# EAGLE schematic iron (EAGLE 8.3.2)
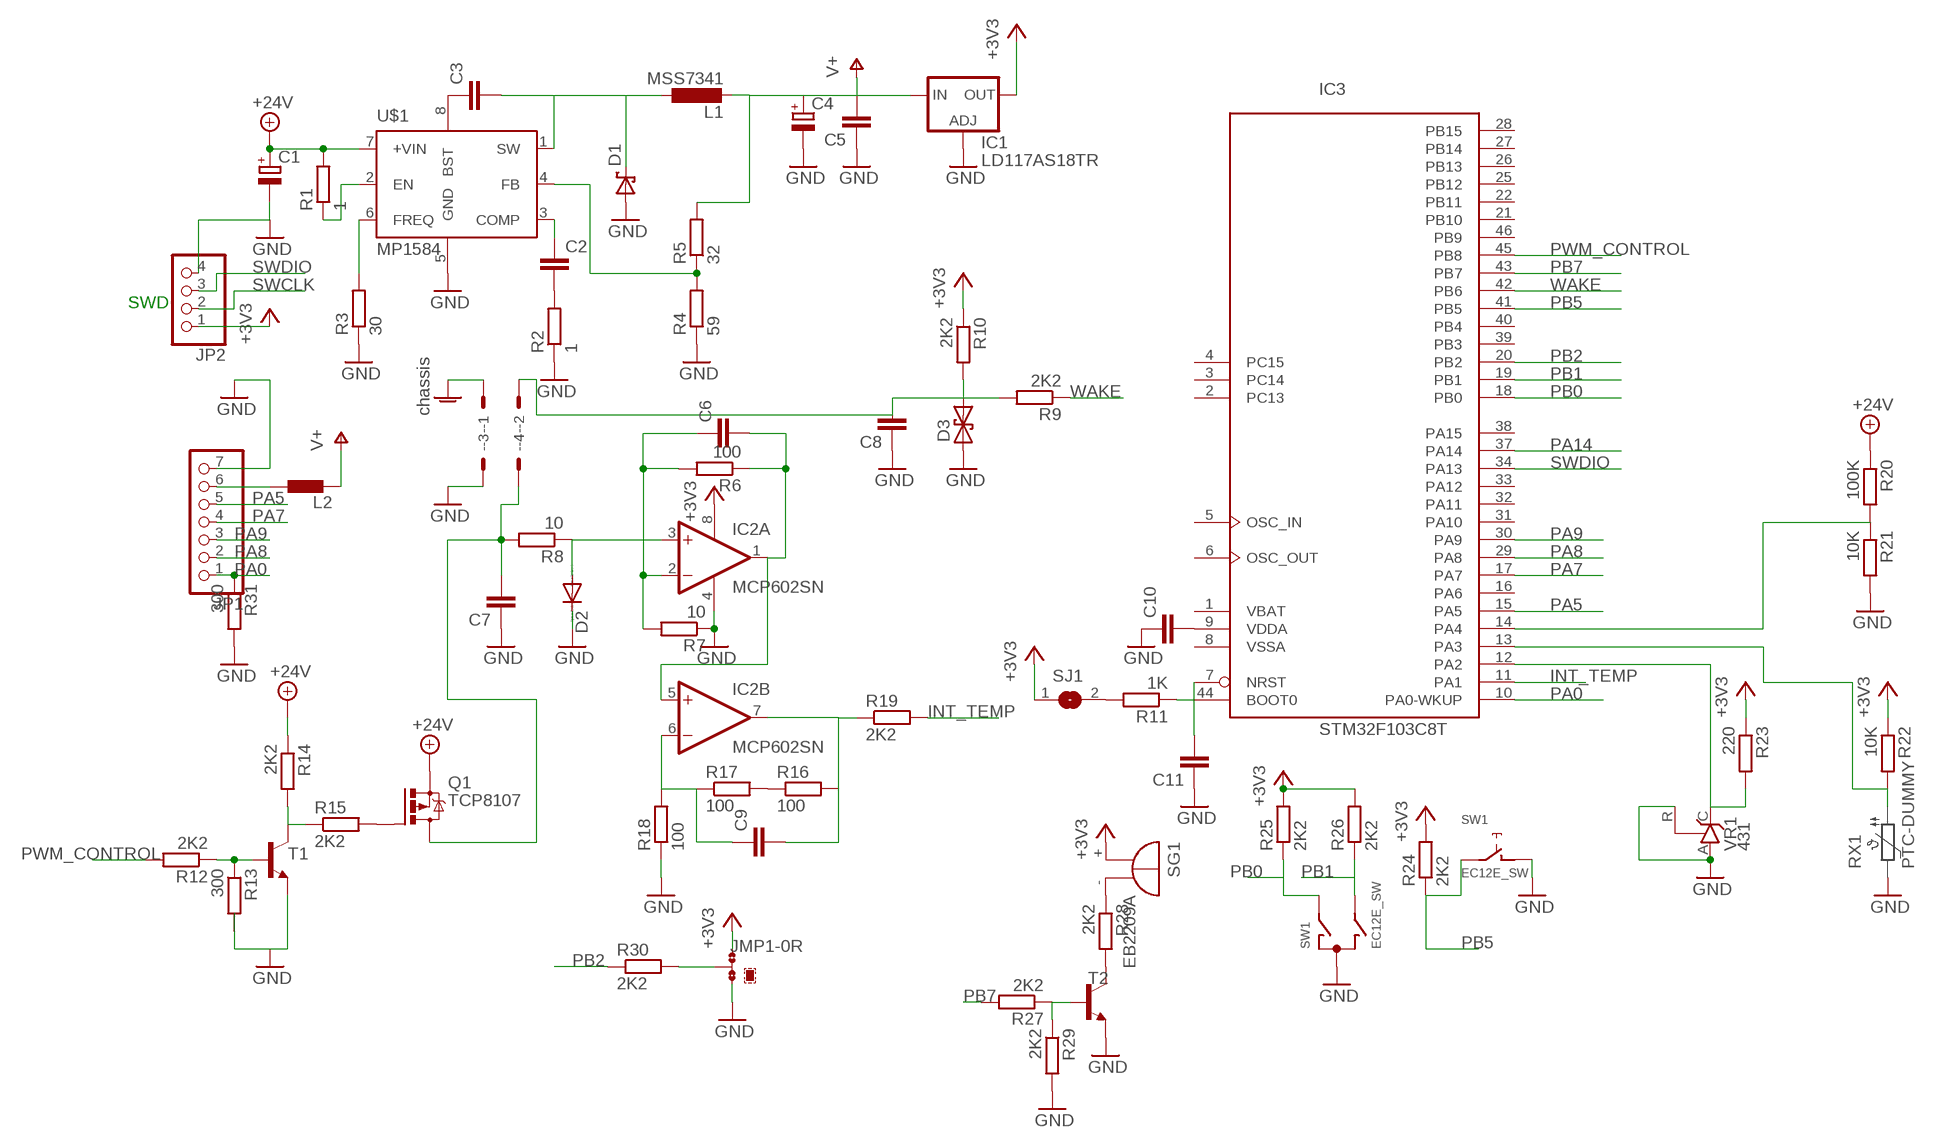
[diagram p0: schematic, sheet 1]

## Parts
-  332-04  [332-04]
C1  CPOL-EUE2,5-6E  [E2,5-6E]
C2  C-EUC0603  [C0603]
C3  C-EUC0603  [C0603]
C4  CPOL-EUE2,5-6E  [E2,5-6E]
C5  C-EUC0603  [C0603]
C6  C-EUC0603  [C0603]
C7  C-EUC0603  [C0603]
C8  C-EUC0603  [C0603]
C9  C-EUC0603  [C0603]
C10  C-EUC0603  [C0603]
C11  C-EUC0603  [C0603]
D1  DS_E2L  [E2LINE]
D2  DIODE-DO214AC  [DO214AC]
D3  BZW04XXB  [F126Z12]
IC1  LD117AS18TR  [SOT223]
IC2  MCP602SN  [SO08]
IC3  STM32F103C8T  [LQFP48]
JMP1  0R-JUMPA  [A0R-JMP]
JP1  PINHD-1X7  [1X07]
JP2  PINHD-1X4  [1X04]
L1  MSS7341  [MSS7341]
L2  BLM15HB121SN1  [0402]
Q1  TCP8107  IRF4905  [TO220BH]
R1  1  R-EU_R0603  [R0603]
R2  1  R-EU_R0603  [R0603]
R3  30  R-EU_R0603  [R0603]
R4  59  R-EU_R0603  [R0603]
R5  32  R-EU_R0603  [R0603]
R6  100  R-EU_R0603  [R0603]
R7  10  R-EU_R0603  [R0603]
R8  10  R-EU_R0603  [R0603]
R9  2K2  R-EU_R0603  [R0603]
R10  2K2  R-EU_R0603  [R0603]
R11  1K  R-EU_R0603  [R0603]
R12  2K2  R-EU_R0603  [R0603]
R13  300  R-EU_R0603  [R0603]
R14  2K2  R-EU_R0603  [R0603]
R15  2K2  R-EU_R0603  [R0603]
R16  100  R-EU_R0603  [R0603]
R17  100  R-EU_R0603  [R0603]
R18  100  R-EU_R0603  [R0603]
R19  2K2  R-EU_R0603  [R0603]
R20  100K  R-EU_R0603  [R0603]
R21  10K  R-EU_R0603  [R0603]
R22  10K  R-EU_R0603  [R0603]
R23  220  R-EU_R0603  [R0603]
R24  2K2  R-EU_R0603  [R0603]
R25  2K2  R-EU_R0603  [R0603]
R26  2K2  R-EU_R0603  [R0603]
R27  2K2  R-EU_R0603  [R0603]
R28  2K2  R-EU_R0603  [R0603]
R29  2K2  R-EU_R0603  [R0603]
R30  2K2  R-EU_R0603  [R0603]
R31  300  R-EU_R0603  [R0603]
SG1  EB2209A  [EB2209A]
SJ1  SJ  [SJ]
SW1  EC12E_SW  [ALPS_EC12E_SW]
T1  -NPN-SOT23-EBC  [SOT23-EBC]
T2  -NPN-SOT23-EBC  [SOT23-EBC]
U$1  MP1584  [SOIC8E]
VR1  431  TL431CLP  [TO92-CLP]

## Nets
+3V3: IC1.4(OUT) IC2.8(P:V+) JMP1.3 JP2.1 R10.1 R22.1 R23.1 R24.2 R25.2 R26.2 SG1.+ SJ1.1
+24V: C1.+ Q1.S R1.2 R14.1 R20.1 U$1.7(+VIN)
GND: -.3 C1.- C4.- C5.1 C7.1 C8.1 C10.1 C11.1 D1.2(A) D2.C D3.A IC1.1(ADJ) IC2.4(P:V-) JMP1.1 JP1.7 JP2.4 R2.1 R3.1 R4.1 R7.1 R13.2 R18.1 R21.2 R29.2 R31.2 SW1.C SW1.D T1.E T2.E U$1.5(GND) VR1.A VR1.R
GNDA: -.1 ; supply symbol labelled chassis
INT_TEMP: IC3.11(PA1) R19.2
N$1: C3.2 D1.1(K) L1.2 U$1.1(SW)
N$2: Q1.G R15.2
N$3: R1.1 U$1.2(EN)
N$4: C2.2 R2.2
N$5: C2.1 U$1.3(COMP)
N$6: R3.2 U$1.6(FREQ)
N$7: C3.1 U$1.8(BST)
N$8: R4.2 R5.1 U$1.4(FB)
N$9: JP1.6 L2.2
N$10: C6.2 IC2.1(A:OUT) IC2.5(B:+IN) R6.1
N$11: C6.1 IC2.2(A:-IN) R6.2 R7.2
N$12: -.4 C7.2 Q1.D R8.2
N$13: D2.A IC2.3(A:+IN) R8.1
N$14: -.2 C8.2 D3.C R9.2 R10.2
N$15: IC3.44(BOOT0) R11.1
N$16: R11.2 SJ1.2
N$18: R12.1 R13.1 T1.B
N$19: R14.2 R15.1 T1.C
N$20: R16.1 R17.2
N$21: R19.1
N$22: IC3.14(PA4) R20.2 R21.1
N$24: IC3.13(PA3) R22.2
N$25: IC3.12(PA2) R23.2 VR1.C
N$26: R27.1 R29.1 T2.B
N$27: R28.2 T2.C
N$28: R28.1 SG1.-
N$29: JMP1.2 R30.2
N$30: C10.2 IC3.9(VDDA)
N$31: C11.2 IC3.7(NRST)
N$32: C9.1 IC2.6(B:-IN) R17.1 R18.2
N$33: C9.2 IC2.7(B:OUT) R16.2
PA0: IC3.10(PA0-WKUP) JP1.1 R31.1
PA5: IC3.15(PA5) JP1.5
PA7: IC3.17(PA7) JP1.4
PA8: IC3.29(PA8) JP1.2
PA9: IC3.30(PA9) JP1.3
PA14: IC3.37(PA14)
PB0: IC3.18(PB0) R25.1 SW1.A
PB1: IC3.19(PB1) R26.1 SW1.B
PB2: IC3.20(PB2) R30.1
PB5: IC3.41(PB5) R24.1 SW1.E
PB7: IC3.43(PB7) R27.2
PWM_CONTROL: IC3.45(PB8) R12.2
SWCLK: JP2.2
SWDIO: IC3.34(PA13) JP2.3
V+: C4.+ C5.2 IC1.3(IN) L1.1 L2.1 R5.2
WAKE: IC3.42(PB6) R9.1
Unconnected: IC3.2(PC13) IC3.3(PC14) IC3.4(PC15) IC3.5(OSC_IN) IC3.6(OSC_OUT) IC3.16(PA6) IC3.21(PB10) IC3.22(PB11) IC3.25(PB12) IC3.26(PB13) IC3.27(PB14) IC3.28(PB15) IC3.31(PA10) IC3.32(PA11) IC3.33(PA12) IC3.38(PA15) IC3.39(PB3) IC3.40(PB4) IC3.46(PB9) SW1.GND1(G) SW1.GND2(G)

## Notes on the sheet
- SWD

## Power pins joined to a net without a drawn wire
VBAT: IC3.1(VBAT)
VDD: IC3.24(VDD) IC3.36(VDD) IC3.48(VDD)
VSS: IC3.23(VSS) IC3.35(VSS) IC3.47(VSS)
VSSA: IC3.8(VSSA)

## Library data of the parts
- = con-garry:332-04: 4 Pin - 2mm Dual Row Source: www.mpe-connector.de / garry_shortform_2012.pdf
C1 C4 = rcl:CPOL-EU: POLARIZED CAPACITOR, European symbol
C2 C3 C5-C11 = rcl:C-EU: CAPACITOR, European symbol
D1 = zetex:DS_E2L: SHOTTKY DIODE; OC_FARNELL: unknown; OC_NEWARK: unknown
D2 = diode:DIODE-: DIODE
D3 = diode:BZW04XXB: DIODE uni and bidirectional supressor diode
IC1 = v-reg:LD117A?*: Low drop fixed and adjustable positive voltage regulators 1 A Source: http://www.st.com/stonline/products/literature/ds/7194/ld1117axx.pdf
IC2 = linear:MCP602: Single Op Amp 2.7V to 6.0V Single Supply CMOS Source: http://ww1.microchip.com/downloads/en/DeviceDoc/21314g.pdf
IC3 = micro-stm_v3:STM32F103C*T: ARM 32-bit Cortex™-M3 CPU 72 MHz maximum frequency 16 to 128 Kbytes of Flash memory 6 to 20 kbytes of SRAM 37 GPIOs 2.0 to 3.6 V application supply
JMP1 = jump-0r-smd:0R-JUMP: SMD 0R 0805 Jumper
JP1 = pinhead:PINHD-1X7: PIN HEADER
JP2 = pinhead:PINHD-1X4: PIN HEADER
L1 = inductor-coilcraft:MSS7341: Shielded Power Inductors Package 6.6 × 6.6 mm x 4.1 mm high Source: http://www.farnell.com/datasheets/1681958.pdf
L2 = inductors:BLM15H: EMIFIL (R) Chip Ferrite Bead for GHz Noise Source: http://www.murata.com/ Ferrite Bead BLM15H.pdf
Q1 = transistor-power:IRF4905: P-Channel HEXFET® Power MOSFET RDS(on)= 0.02 Ohm, ID = -74A Source: http://www.irf.com/product-info/datasheets/data/irf4905pbf.pdf
R1-R31 = rcl:R-EU_: RESISTOR, European symbol
SG1 = buzzer:EB2209A: BUZZER Source: Buerklin; OC_FARNELL: unknown; OC_NEWARK: unknown
SJ1 = jumper:SJ: SMD solder JUMPER
SW1 = switch-alps:EC12E_SW: ALPS rotary Encoder EC12E series with switch; MPN: EC12E2424407; OC_FARNELL: 1520813; OC_NEWARK: 74M1068
T1 T2 = transistor:*-NPN-: NPN Transistror BF959 corrected 2008.03.06
U$1 = dc-dc-converter:MP1584
VR1 = v-reg:TL431CLP: VOLTAGE REGULATOR